# Altium schematic sheet SDRAM.SchDoc
size 420 x 297 mm; DocumentNumber: АЕСН.466369.100Э3; SheetNumber: 4; SheetTotal: x; DocumentName: Sheet1.SCHDOC
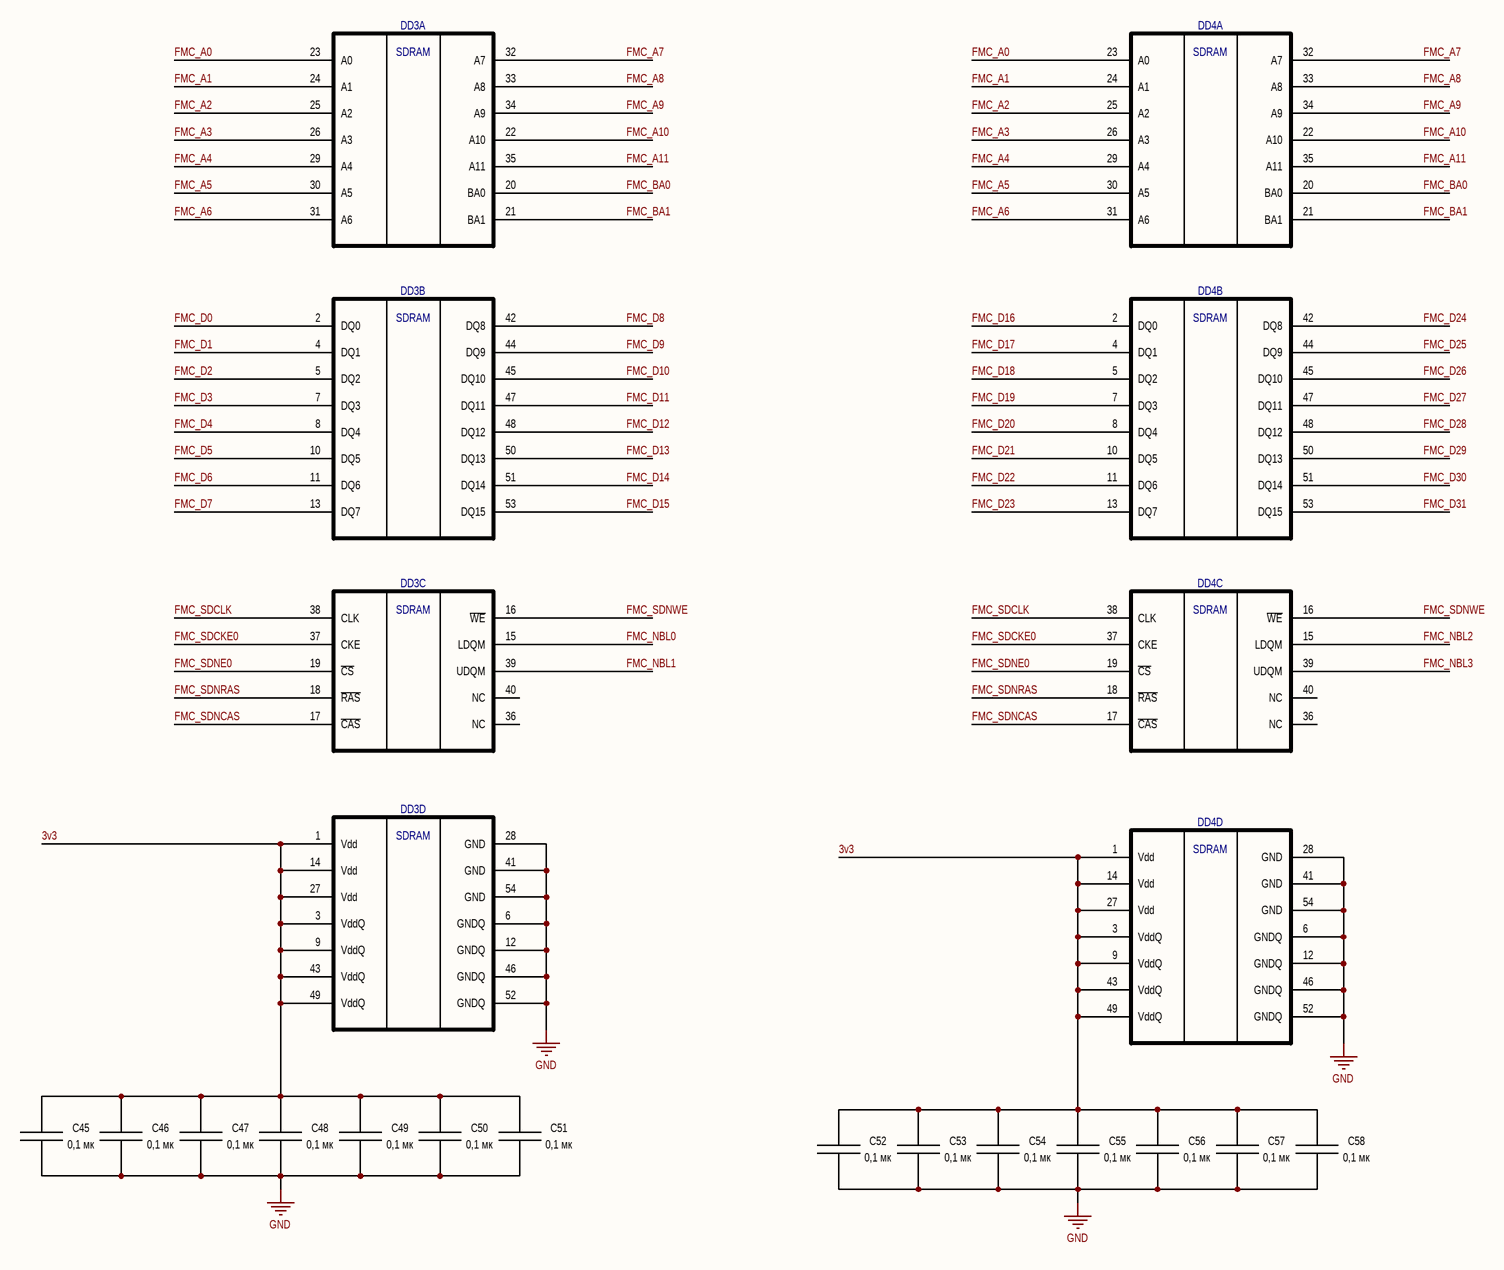
[diagram p0: SDRAM.SchDoc]

## Parts
C45  value 0,1 мк  [C0603]  (hidden comment: C)
C46  value 0,1 мк  [C0603]  (hidden comment: C)
C47  value 0,1 мк  [C0603]  (hidden comment: C)
C48  value 0,1 мк  [C0603]  (hidden comment: C)
C49  value 0,1 мк  [C0603]  (hidden comment: C)
C50  value 0,1 мк  [C0603]  (hidden comment: C)
C51  value 0,1 мк  [C0603]  (hidden comment: C)
C52  value 0,1 мк  [C0603]  (hidden comment: C)
C53  value 0,1 мк  [C0603]  (hidden comment: C)
C54  value 0,1 мк  [C0603]  (hidden comment: C)
C55  value 0,1 мк  [C0603]  (hidden comment: C)
C56  value 0,1 мк  [C0603]  (hidden comment: C)
C57  value 0,1 мк  [C0603]  (hidden comment: C)
C58  value 0,1 мк  [C0603]  (hidden comment: C)
DD3  IS42S16400J  [TSOP-54]  (value not drawn)  (parts A,B,C,D of 4)
DD4  IS42S16400J  [TSOP-54]  (value not drawn)  (parts A,B,C,D of 4)

## Nets
GND: C45.2 C46.2 C47.2 C48.2 C49.2 C50.2 C51.2 C52.2 C53.2 C54.2 C55.2 C56.2 C57.2 C58.2 DD3.6(GNDQ) DD3.12(GNDQ) DD3.28(GND) DD3.41(GND) DD3.46(GNDQ) DD3.52(GNDQ) DD3.54(GND) DD4.6(GNDQ) DD4.12(GNDQ) DD4.28(GND) DD4.41(GND) DD4.46(GNDQ) DD4.52(GNDQ) DD4.54(GND)
3v3: C45.1 C46.1 C47.1 C48.1 C49.1 C50.1 C51.1 C52.1 C53.1 C54.1 C55.1 C56.1 C57.1 C58.1 DD3.1(Vdd) DD3.3(VddQ) DD3.9(VddQ) DD3.14(Vdd) DD3.27(Vdd) DD3.43(VddQ) DD3.49(VddQ) DD4.1(Vdd) DD4.3(VddQ) DD4.9(VddQ) DD4.14(Vdd) DD4.27(Vdd) DD4.43(VddQ) DD4.49(VddQ)
FMC_A0: DD3.23(A0) DD4.23(A0)
FMC_A1: DD3.24(A1) DD4.24(A1)
FMC_A2: DD3.25(A2) DD4.25(A2)
FMC_A3: DD3.26(A3) DD4.26(A3)
FMC_A4: DD3.29(A4) DD4.29(A4)
FMC_A5: DD3.30(A5) DD4.30(A5)
FMC_A6: DD3.31(A6) DD4.31(A6)
FMC_A7: DD3.32(A7) DD4.32(A7)
FMC_A8: DD3.33(A8) DD4.33(A8)
FMC_A9: DD3.34(A9) DD4.34(A9)
FMC_A10: DD3.22(A10) DD4.22(A10)
FMC_A11: DD3.35(A11) DD4.35(A11)
FMC_BA0: DD3.20(BA0) DD4.20(BA0)
FMC_BA1: DD3.21(BA1) DD4.21(BA1)
FMC_D0: DD3.2(DQ0)
FMC_D1: DD3.4(DQ1)
FMC_D2: DD3.5(DQ2)
FMC_D3: DD3.7(DQ3)
FMC_D4: DD3.8(DQ4)
FMC_D5: DD3.10(DQ5)
FMC_D6: DD3.11(DQ6)
FMC_D7: DD3.13(DQ7)
FMC_D8: DD3.42(DQ8)
FMC_D9: DD3.44(DQ9)
FMC_D10: DD3.45(DQ10)
FMC_D11: DD3.47(DQ11)
FMC_D12: DD3.48(DQ12)
FMC_D13: DD3.50(DQ13)
FMC_D14: DD3.51(DQ14)
FMC_D15: DD3.53(DQ15)
FMC_D16: DD4.2(DQ0)
FMC_D17: DD4.4(DQ1)
FMC_D18: DD4.5(DQ2)
FMC_D19: DD4.7(DQ3)
FMC_D20: DD4.8(DQ4)
FMC_D21: DD4.10(DQ5)
FMC_D22: DD4.11(DQ6)
FMC_D23: DD4.13(DQ7)
FMC_D24: DD4.42(DQ8)
FMC_D25: DD4.44(DQ9)
FMC_D26: DD4.45(DQ10)
FMC_D27: DD4.47(DQ11)
FMC_D28: DD4.48(DQ12)
FMC_D29: DD4.50(DQ13)
FMC_D30: DD4.51(DQ14)
FMC_D31: DD4.53(DQ15)
FMC_NBL0: DD3.15(LDQM)
FMC_NBL1: DD3.39(UDQM)
FMC_NBL2: DD4.15(LDQM)
FMC_NBL3: DD4.39(UDQM)
FMC_SDCKE0: DD3.37(CKE) DD4.37(CKE)
FMC_SDCLK: DD3.38(CLK) DD4.38(CLK)
FMC_SDNCAS: DD3.17(~{CAS}) DD4.17(~{CAS})
FMC_SDNE0: DD3.19(~{CS}) DD4.19(~{CS})
FMC_SDNRAS: DD3.18(~{RAS}) DD4.18(~{RAS})
FMC_SDNWE: DD3.16(~{WE}) DD4.16(~{WE})

Not connected (* = marked no-connect by the designer): DD3 36(NC) 40(NC); DD4 36(NC) 40(NC)

## Notes on the sheet
- Подп. и дата
- Инв.№ дубл.
- Взам. инв. №
- Инв № подл.
- Изм.
- Лист
- № докум.
- Подп.
- Дата
- Копировал
- Формат А3
- (in symbol IS42S16400J, part A) SDRAM
- (in symbol IS42S16400J, part B) SDRAM
- (in symbol IS42S16400J, part C) SDRAM
- (in symbol IS42S16400J, part D) SDRAM

## Library data of the parts
C45-C58 = C: PartNumber: GRM188R71H104KA93D; Tolerance: ±10%; Voltage: 50 В; Dielectric: X7R; Case: 0603; Mount: *